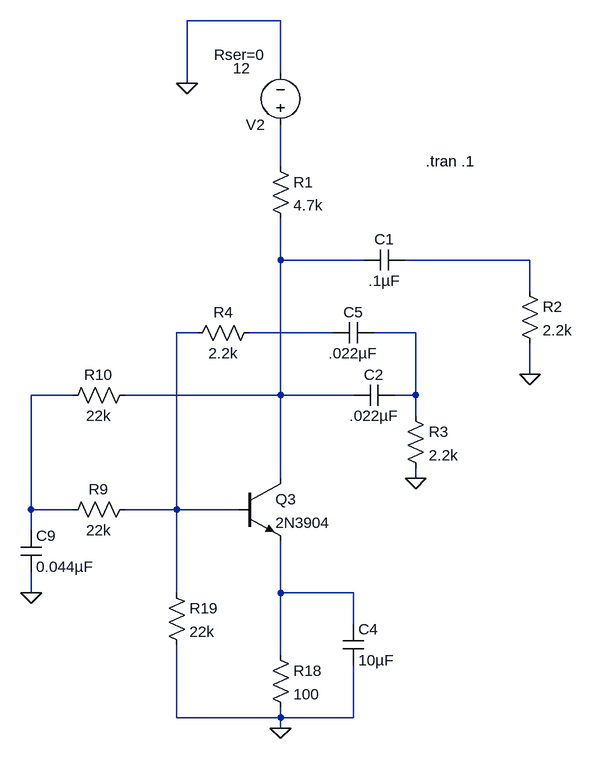
[diagram p0: schematic Side Tone.asc]
Side Tone.asc, the LTspice schematic file:
Version 4
SHEET 1 3352 1348
WIRE -1696 -416 -1840 -416
WIRE -1696 -336 -1696 -416
WIRE -1840 -320 -1840 -416
WIRE -1696 -192 -1696 -256
WIRE -1696 -48 -1696 -112
WIRE -1568 -48 -1696 -48
WIRE -1312 -48 -1504 -48
WIRE -1312 0 -1312 -48
WIRE -1824 64 -1856 64
WIRE -1616 64 -1744 64
WIRE -1488 64 -1552 64
WIRE -1312 128 -1312 80
WIRE -2016 160 -2080 160
WIRE -1696 160 -1696 -48
WIRE -1696 160 -1936 160
WIRE -1584 160 -1696 160
WIRE -1488 160 -1488 64
WIRE -1488 160 -1520 160
WIRE -1488 192 -1488 160
WIRE -1696 288 -1696 160
WIRE -1488 288 -1488 272
WIRE -2080 336 -2080 160
WIRE -2016 336 -2080 336
WIRE -1856 336 -1856 64
WIRE -1856 336 -1936 336
WIRE -1760 336 -1856 336
WIRE -2080 368 -2080 336
WIRE -2080 464 -2080 432
WIRE -1856 464 -1856 336
WIRE -1696 464 -1696 384
WIRE -1584 464 -1696 464
WIRE -1584 512 -1584 464
WIRE -1696 560 -1696 464
WIRE -1856 656 -1856 544
WIRE -1696 656 -1696 640
WIRE -1696 656 -1856 656
WIRE -1584 656 -1584 576
WIRE -1584 656 -1696 656
WIRE -1696 672 -1696 656
FLAG -1840 -320 0
FLAG -1696 672 0
FLAG -1312 128 0
FLAG -2080 464 0
FLAG -1488 288 0
SYMBOL voltage -1696 -240 R180
WINDOW 123 0 0 Left 0
WINDOW 39 24 124 Left 2
WINDOW 3 46 103 Left 2
SYMATTR SpiceLine Rser=0
SYMATTR Value 12
SYMATTR InstName V2
SYMBOL res -1712 544 R0
SYMATTR InstName R18
SYMATTR Value 100
SYMBOL npn -1760 288 R0
SYMATTR InstName Q3
SYMATTR Value 2N3904
SYMBOL cap -1600 512 R0
SYMATTR InstName C4
SYMATTR Value 10µF
SYMBOL res -1872 448 R0
SYMATTR InstName R19
SYMATTR Value 22k
SYMBOL res -1712 -208 R0
SYMATTR InstName R1
SYMATTR Value 4.7k
SYMBOL cap -1504 -64 R90
WINDOW 0 0 32 VBottom 2
WINDOW 3 32 32 VTop 2
SYMATTR InstName C1
SYMATTR Value .1µF
SYMBOL res -1328 -16 R0
SYMATTR InstName R2
SYMATTR Value 2.2k
SYMBOL cap -1520 144 R90
WINDOW 0 0 32 VBottom 2
WINDOW 3 32 32 VTop 2
SYMATTR InstName C2
SYMATTR Value .022µF
SYMBOL res -1504 176 R0
SYMATTR InstName R3
SYMATTR Value 2.2k
SYMBOL cap -1552 48 R90
WINDOW 0 0 32 VBottom 2
WINDOW 3 32 32 VTop 2
SYMATTR InstName C5
SYMATTR Value .022µF
SYMBOL res -1728 48 R90
WINDOW 0 0 56 VBottom 2
WINDOW 3 32 56 VTop 2
SYMATTR InstName R4
SYMATTR Value 2.2k
SYMBOL res -1920 320 R90
WINDOW 0 0 56 VBottom 2
WINDOW 3 32 56 VTop 2
SYMATTR InstName R9
SYMATTR Value 22k
SYMBOL cap -2096 368 R0
SYMATTR InstName C9
SYMATTR Value 0.044µF
SYMBOL res -1920 144 R90
WINDOW 0 0 56 VBottom 2
WINDOW 3 32 56 VTop 2
SYMATTR InstName R10
SYMATTR Value 22k
TEXT -1472 -200 Left 2 !.tran .1

The netlist it stands for:
* Side Tone.asc
V2 N001 0 12 Rser=0
R18 N008 0 100
Q3 N002 N004 N008 0 2N3904
C4 N008 0 10µF
R19 N004 0 22k
R1 N001 N002 4.7k
C1 N003 N002 .1µF
R2 N003 0 2.2k
C2 N006 N002 .022µF
R3 N006 0 2.2k
C5 N006 N005 .022µF
R4 N005 N004 2.2k
R9 N004 N007 22k
C9 N007 0 0.044µF
R10 N002 N007 22k
.model NPN NPN
.model PNP PNP
.lib standard.bjt
.tran .1
.backanno
.end